# Altium schematic sheet TH Sensor Output Socket.SchDoc: Air Temperature & Air Humidity Sensor Output Socket
size A4; SheetNumber: 30; SheetTotal: 37
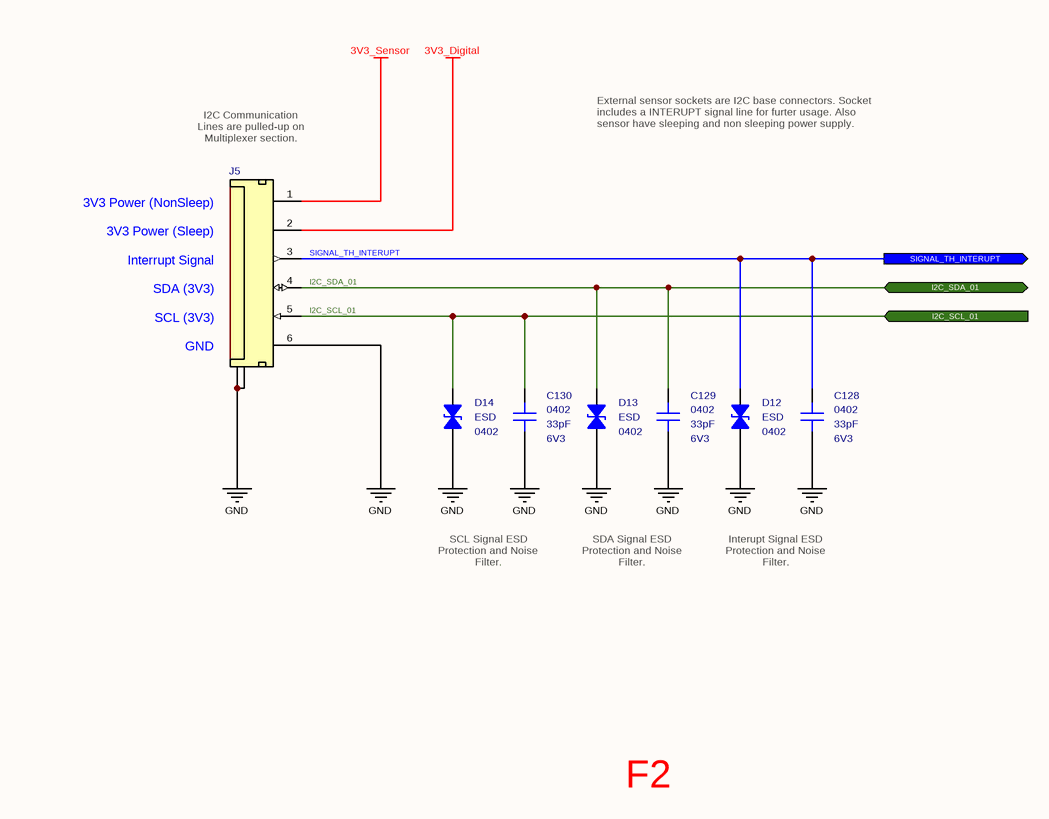
[diagram p0: TH Sensor Output Socket.SchDoc]

## Parts
C128  value 33pF  Case: 0402  Voltage: 6V3  [CAPACITOR_0402]  (hidden comment: Multilayer Ceramic Capacitor)
C129  value 33pF  Case: 0402  Voltage: 6V3  [CAPACITOR_0402]  (hidden comment: Multilayer Ceramic Capacitor)
C130  value 33pF  Case: 0402  Voltage: 6V3  [CAPACITOR_0402]  (hidden comment: Multilayer Ceramic Capacitor)
D12  Case: 0402  [ESD_0402]  (hidden comment: ESD Suppressors)
D13  Case: 0402  [ESD_0402]  (hidden comment: ESD Suppressors)
D14  Case: 0402  [ESD_0402]  (hidden comment: ESD Suppressors)
J5  T/H Sensor Socket  [Connector_Tunic 6P - H]  (value not drawn)

## Ports
I2C_SCL_01 (in), I2C_SDA_01 (bidir), SIGNAL_TH_INTERUPT (out)

## Nets
3V3_Digital: J5.2(3V3_Digital)
3V3_Sensor: J5.1(3V3_Sensor)
GND: C128.1 C129.1 C130.1 D12.1 D13.1 D14.1 J5.6(GND) J5.7(Termination) J5.8(Termination)
I2C_SCL_01: C130.2 D14.2 J5.5(SCL01) ; port I2C_SCL_01
I2C_SDA_01: C129.2 D13.2 J5.4(SDA01) ; port I2C_SDA_01
SIGNAL_TH_INTERUPT: C128.2 D12.2 J5.3(TH_Interupt) ; port SIGNAL_TH_INTERUPT

## Notes on the sheet
- I2C Communication Lines are pulled-up on Multiplexer section.
- External sensor sockets are I2C base connectors. Socket includes a INTERUPT signal line for furter usage. Also sensor have sleeping and non sleeping power supply.
- (near J5) 3V3 Power (NonSleep)
  3V3 Power (Sleep)
  Interrupt Signal
  SDA (3V3)
  SCL (3V3)
  GND
- SCL Signal ESD Protection and Noise Filter.
- SDA Signal ESD Protection and Noise Filter.
- Interupt Signal ESD Protection and Noise Filter.
- F2
- Title
- Size:
- Date:
- A4
- Number:
- Time:
- Revision:
- Sheet
- of
- File:
- (in symbol Diode - ESD Protection) ESD

## Library data of the parts
C128-C130 = Capacitor - 33pF [0402-6V3]: Capacitor - 33pF [0402] (Ceramic); Manufacturer_Name: Kemet; Manufacturer_Part_Number: C0402C330J9RACAUTO; Dielectric: X7R; Tolerance: 10%; Height: 0.5mm; Mouser_Part_Number: 80-C0402C330J9RAUTO; Maximum Operating Temperature: +125; Minimum Operating Temperature: -55; ROHS: Yes; ComponentLink1Description: DataSheet; ComponentLink1URL: https://api.kemet.com/component-edge/download/datasheet/C0402C330J9RACAUTO.pdf; ComponentLink2Description: Mouser; ComponentLink2URL: https://www.mouser.com/Search/Refine.aspx?Keyword=80-C0402C330J9RAUTO; Supplier 1: Mouser; Supplier Part Number 1: 80-C0402C330J9RAUTO
D12-D14 = Diode - ESD Protection: TVS Diode (Bi-directional); Manufacturer_Name: Bussmann / Eaton; Manufacturer_Part_Number: 0402ESDA-MLP1; Clamping Voltage: 35V; Diode Capacitance: 0.05pF; Polarity: Bidirectional; Voltage ESD Air Gap: 15kV; Voltage ESD Contact: 8kV; Working Voltage: 30V; Height: 0.436mm; Mouser_Part_Number: 504-0402ESDA-MLP1; Maximum Operating Temperature: +125; Minimum Operating Temperature: -55; ROHS: Yes; ComponentLink1Description: DataSheet; ComponentLink1URL: https://www.mouser.com.tr/datasheet/2/87/47c59e11-d058-4882-bc35-d8572f2ca054-38826.pdf; ComponentLink2Description: Mouser; ComponentLink2URL: https://www.mouser.com.tr/ProductDetail/Bussmann-Eaton/0402ESDA-MLP1?qs=%2Fha2pyFadughxyc7TyLWeW%2FUvipVY6Ex3naV%2FjpO3plZBZWDLqV4bw%3D%3D; Supplier 1: Mouser; Supplier 2: Digi-Key; Supplier Part Number 2: 283-2964-1-ND; Supplier Part Number 1: 504-0402ESDA-MLP1
J5 = Connector - Mini Tunic 6P (1.25): Mini Tunic Connector with 6P; Manufacturer_Name: Molex; Manufacturer_Part_Number: 53261-0671; ROHS: Yes; Supplier 1: Avnet; Supplier 2: Mouser; Supplier 3: Arrow; Supplier 4: Farnell; Supplier 5: Newark; Supplier 6: Digi-Key; Supplier Part Number 1: 0532610671; Supplier Part Number 2: 538-53261-0671; Supplier Part Number 3: 53261-0671; Supplier Part Number 4: 1125375; Supplier Part Number 5: 93K4246; Supplier Part Number 6: WM7624CT-ND; System: Connector